# Altium schematic sheet 04 TYPEC.SchDoc: CM4 IO
size 420 x 297 mm; Page Create Date: March  8, 1995; Page Number: 4; Page Size: A3; Comment: radxa_1010; Page Count: 19; RevCode: V1.10; Doc: 04 TYPEC; DsnPath: D:\WMS\黄工\[RC126]CM4_IO_V1.10\[RC126]_V1.10\CM4 IO_V1.10.DSN; SchematicName: CM4 IO V1.10; PageName: 04 TYPEC; PageSize: A3; TopSchematic: True
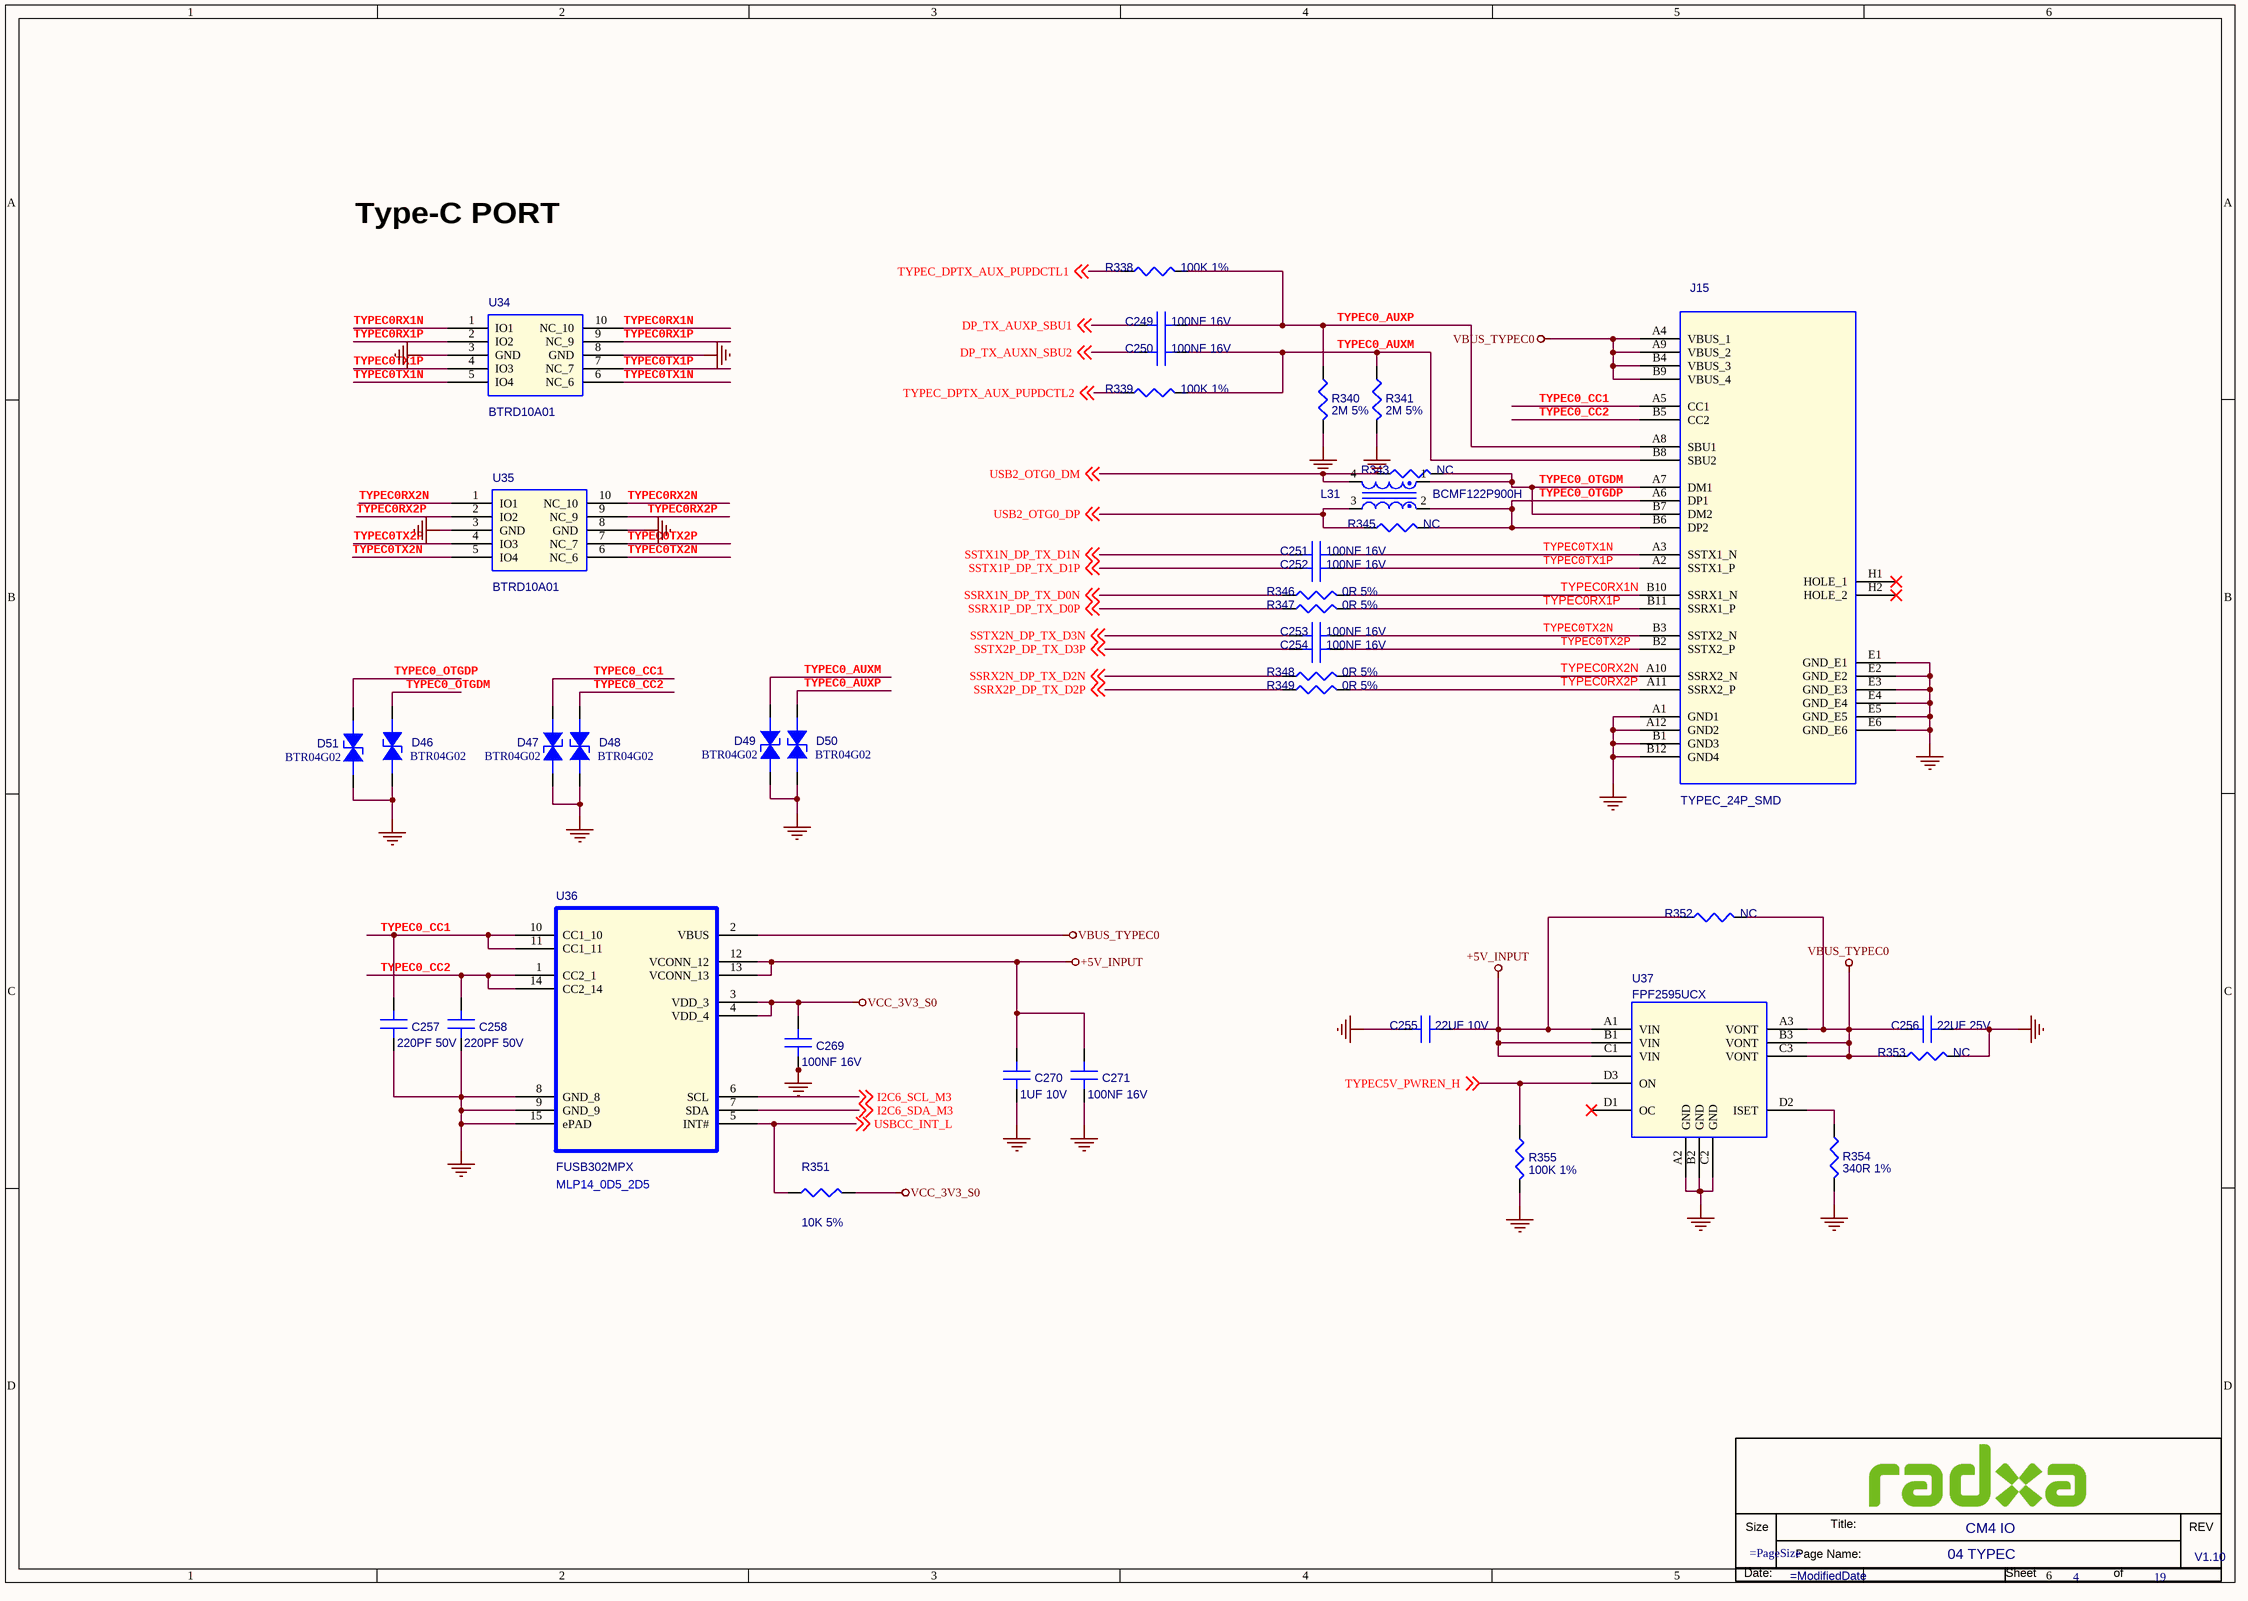
[diagram p0: 04 TYPEC.SchDoc]

## Parts
*  Doc: 04 TYPEC  RevCode: V1.10  Title: CM4 IO  Page Number: 4  Page Count: 19  (hidden comment: radxa_1010)  (graphical)
C249  100NF 16V  [C0201]
C250  100NF 16V  [C0201]
C251  100NF 16V  [C0201]
C252  100NF 16V  [C0201]
C253  100NF 16V  [C0201]
C254  100NF 16V  [C0201]
C255  22UF 10V  [C0603]
C256  22UF 25V  [C0805]
C257  220PF 50V  [C0201]
C258  220PF 50V  [C0201]
C269  100NF 16V  [C0201]
C270  1UF 10V  [C0201]
C271  100NF 16V  [C0201]
D46  BTR04G02  [DFN1006-2L]
D47  BTR04G02  [DFN1006-2L]
D48  BTR04G02  [DFN1006-2L]
D49  BTR04G02  [DFN1006-2L]
D50  BTR04G02  [DFN1006-2L]
D51  BTR04G02  [DFN1006-2L]
J15  TYPEC_24P_SMD  [TYPEC_SM24P_0D5]
L31  BCMF122P900H  [LC1210]
R338  100K 1%  [R0402]
R339  100K 1%  [R0402]
R340  2M 5%  [R0402]
R341  2M 5%  [R0402]
R343  NC  [R0402]
R345  NC  [R0402]
R346  0R 5%  [R0402]
R347  0R 5%  [R0402]
R348  0R 5%  [R0402]
R349  0R 5%  [R0402]
R351  10K 5%  [R0402]
R352  NC  [R0402]
R353  NC  [R0402]
R354  340R 1%  [R0402]
R355  100K 1%  [R0402]
U34  BTRD10A01  [SON10_0D5_1]
U35  BTRD10A01  [SON10_0D5_1]
U36  FUSB302MPX  [MLP14_0D5_2D5]
U37  FPF2595UCX  [WLCSP12_0D4_1D5]

## Nets
+5V_INPUT: C255.1(A) C270.1(A) C271.1(A) R352.1 U36.12(VCONN_12) U36.13(VCONN_13) U37.A1(VIN) U37.B1(VIN) U37.C1(VIN)
GND: C255.2(B) C256.2(B) C257.2(B) C258.2(B) C269.2(B) C270.2(B) C271.2(B) D46.1(ANODE) D47.1(ANODE) D48.1(ANODE) D49.1(ANODE) D50.1(ANODE) D51.1(ANODE) J15.A1(GND1) J15.A12(GND2) J15.B1(GND3) J15.B12(GND4) J15.E1(GND_E1) J15.E2(GND_E2) J15.E3(GND_E3) J15.E4(GND_E4) J15.E5(GND_E5) J15.E6(GND_E6) R340.2 R341.2 R353.2 R354.2 R355.2 U34.3(GND) U34.8(GND) U35.3(GND) U35.8(GND) U36.8(GND_8) U36.9(GND_9) U36.15(ePAD) U37.A2(GND) U37.B2(GND) U37.C2(GND)
VBUS_TYPEC0: C256.1(A) J15.A4(VBUS_1) J15.A9(VBUS_2) J15.B4(VBUS_3) J15.B9(VBUS_4) R352.2 R353.1 U36.2(VBUS) U37.A3(VONT) U37.B3(VONT) U37.C3(VONT)
VCC_3V3_S0: C269.1(A) R351.1 U36.3(VDD_3) U36.4(VDD_4)
DP_TX_AUXN_SBU2: C250.1(A) ; off-sheet DP_TX_AUXN_SBU2
DP_TX_AUXP_SBU1: C249.1(A) ; off-sheet DP_TX_AUXP_SBU1
I2C6_SCL_M3: U36.6(SCL) ; off-sheet I2C6_SCL_M3
I2C6_SDA_M3: U36.7(SDA) ; off-sheet I2C6_SDA_M3
SSRX1N_DP_TX_D0N: R346.1 ; off-sheet SSRX1N_DP_TX_D0N
SSRX1P_DP_TX_D0P: R347.1 ; off-sheet SSRX1P_DP_TX_D0P
SSRX2N_DP_TX_D2N: R348.1 ; off-sheet SSRX2N_DP_TX_D2N
SSRX2P_DP_TX_D2P: R349.1 ; off-sheet SSRX2P_DP_TX_D2P
SSTX1N_DP_TX_D1N: C251.1(A) ; off-sheet SSTX1N_DP_TX_D1N
SSTX1P_DP_TX_D1P: C252.1(A) ; off-sheet SSTX1P_DP_TX_D1P
SSTX2N_DP_TX_D3N: C253.1(A) ; off-sheet SSTX2N_DP_TX_D3N
SSTX2P_DP_TX_D3P: C254.1(A) ; off-sheet SSTX2P_DP_TX_D3P
TYPEC0_AUXM: C250.2(B) D49.2(CATHODE) J15.B8(SBU2) R339.2 R341.1
TYPEC0_AUXP: C249.2(B) D50.2(CATHODE) J15.A8(SBU1) R338.2 R340.1
TYPEC0_CC1: C257.1(A) D47.2(CATHODE) J15.A5(CC1) U36.10(CC1_10) U36.11(CC1_11)
TYPEC0_CC2: C258.1(A) D48.2(CATHODE) J15.B5(CC2) U36.1(CC2_1) U36.14(CC2_14)
TYPEC0_OTGDM: D46.2(CATHODE) J15.A7(DM1) J15.B7(DM2) L31.1 R343.2
TYPEC0_OTGDP: D51.2(CATHODE) J15.A6(DP1) J15.B6(DP2) L31.2 R345.2
TYPEC0RX1N: J15.B10(SSRX1_N) R346.2 U34.1(IO1) U34.10(NC_10)
TYPEC0RX1P: J15.B11(SSRX1_P) R347.2 U34.2(IO2) U34.9(NC_9)
TYPEC0RX2N: J15.A10(SSRX2_N) R348.2 U35.1(IO1) U35.10(NC_10)
TYPEC0RX2P: J15.A11(SSRX2_P) R349.2 U35.2(IO2) U35.9(NC_9)
TYPEC0TX1N: C251.2(B) J15.A3(SSTX1_N) U34.5(IO4) U34.6(NC_6)
TYPEC0TX1P: C252.2(B) J15.A2(SSTX1_P) U34.4(IO3) U34.7(NC_7)
TYPEC0TX2N: C253.2(B) J15.B3(SSTX2_N) U35.5(IO4) U35.6(NC_6)
TYPEC0TX2P: C254.2(B) J15.B2(SSTX2_P) U35.4(IO3) U35.7(NC_7)
TYPEC5V_PWREN_H: R355.1 U37.D3(ON) ; off-sheet TYPEC5V_PWREN_H
TYPEC_DPTX_AUX_PUPDCTL1: R338.1 ; off-sheet TYPEC_DPTX_AUX_PUPDCTL1
TYPEC_DPTX_AUX_PUPDCTL2: R339.1 ; off-sheet TYPEC_DPTX_AUX_PUPDCTL2
USB2_OTG0_DM: L31.4 R343.1 ; off-sheet USB2_OTG0_DM
USB2_OTG0_DP: L31.3 R345.1 ; off-sheet USB2_OTG0_DP
USBCC_INT_L: R351.2 U36.5(INT#) ; off-sheet USBCC_INT_L
NetR354_1: R354.1 U37.D2(ISET)

Not connected (* = marked no-connect by the designer): J15 H1(HOLE_1)* H2(HOLE_2)*; U37 D1(OC)*

## Notes on the sheet
- Type-C PORT
- (in symbol radxa_1010) Size; Title:; REV; Page Name:; Date:; Sheet; of

## Library data of the parts
C249 = C: SMD  0201  100NF  16V  X5R  ±20%  ROHS; PARTS: 1; Part Reference: C249; Part Number: A1C01.00099; OriginalSymbolOrigin: (0,30); PKG_TYPE: CAP2-100-250; LEVEL: STD; PINSWAP: (A,B); Preferred: 6715f349cd0bc5; Value: 100NF 16V; Part Type: 陶瓷电容; PCB Footprint: C0201
C250 = C: SMD  0201  100NF  16V  X5R  ±20%  ROHS; PARTS: 1; Part Reference: C250; Part Number: A1C01.00099; OriginalSymbolOrigin: (0,30); PKG_TYPE: CAP2-100-250; LEVEL: STD; PINSWAP: (A,B); Preferred: 6715f349cd0bc5; Value: 100NF 16V; Part Type: 陶瓷电容; PCB Footprint: C0201
C251 = C: SMD  0201  100NF  16V  X5R  ±20%  ROHS; PARTS: 1; Part Reference: C251; Part Number: A1C01.00099; OriginalSymbolOrigin: (0,30); PKG_TYPE: CAP2-100-250; LEVEL: STD; PINSWAP: (A,B); Preferred: 6715f349cd0bc5; Value: 100NF 16V; Part Type: 陶瓷电容; PCB Footprint: C0201
C252 = C: SMD  0201  100NF  16V  X5R  ±20%  ROHS; PARTS: 1; Part Reference: C252; Part Number: A1C01.00099; OriginalSymbolOrigin: (0,30); PKG_TYPE: CAP2-100-250; LEVEL: STD; PINSWAP: (A,B); Preferred: 6715f349cd0bc5; Value: 100NF 16V; Part Type: 陶瓷电容; PCB Footprint: C0201
C253 = C: SMD  0201  100NF  16V  X5R  ±20%  ROHS; PARTS: 1; Part Reference: C253; Part Number: A1C01.00099; OriginalSymbolOrigin: (0,30); PKG_TYPE: CAP2-100-250; LEVEL: STD; PINSWAP: (A,B); Preferred: 6715f349cd0bc5; Value: 100NF 16V; Part Type: 陶瓷电容; PCB Footprint: C0201
C254 = C: SMD  0201  100NF  16V  X5R  ±20%  ROHS; PARTS: 1; Part Reference: C254; Part Number: A1C01.00099; OriginalSymbolOrigin: (0,30); PKG_TYPE: CAP2-100-250; LEVEL: STD; PINSWAP: (A,B); Preferred: 6715f349cd0bc5; Value: 100NF 16V; Part Type: 陶瓷电容; PCB Footprint: C0201
C255 = C: SMD  0603  22UF  10V  X5R  ±20%  ROHS; PARTS: 1; Part Reference: C255; Part Number: A1C01.00015; OriginalSymbolOrigin: (0,30); PKG_TYPE: CAP2-100-250; LEVEL: STD; PINSWAP: (A,B); Preferred: 6715f349cd0bc5; Value: 22UF 10V; Part Type: 陶瓷电容; PCB Footprint: C0603
C256 = C: SMD  0805  22UF  25V  X5R  ±20%  ROHS; PARTS: 1; Part Reference: C256; Part Number: A1C01.00249; OriginalSymbolOrigin: (0,30); PKG_TYPE: CAP2-100-250; LEVEL: STD; PINSWAP: (A,B); Preferred: 6715f349cd0bc5; Value: 22UF 25V; Part Type: 陶瓷电容
C257 = C: SMD  0201  220PF  50V  NPO  ±5%  ROHS; PARTS: 1; Part Reference: C257; Part Number: A1C01.00383; OriginalSymbolOrigin: (0,30); PKG_TYPE: CAP2-100-250; LEVEL: STD; PINSWAP: (A,B); Preferred: 6715f349cd0bc5; Value: 220PF 50V; Part Type: 陶瓷电容; PCB Footprint: C0201
C258 = C: SMD  0201  220PF  50V  NPO  ±5%  ROHS; PARTS: 1; Part Reference: C258; Part Number: A1C01.00383; OriginalSymbolOrigin: (0,30); PKG_TYPE: CAP2-100-250; LEVEL: STD; PINSWAP: (A,B); Preferred: 6715f349cd0bc5; Value: 220PF 50V; Part Type: 陶瓷电容; PCB Footprint: C0201
C269 = C: SMD  0201  100NF  16V  X5R  ±20%  ROHS; PARTS: 1; Part Reference: C269; Part Number: A1C01.00099; OriginalSymbolOrigin: (0,30); PKG_TYPE: CAP2-100-250; LEVEL: STD; PINSWAP: (A,B); Preferred: 6715f349cd0bc5; Value: 100NF 16V; Part Type: 陶瓷电容; PCB Footprint: C0201
C270 = C: SMD  0201  1UF  10V  X5R  ±20%  ROHS; PARTS: 1; Part Reference: C270; Part Number: A1C01.00081; OriginalSymbolOrigin: (0,30); PKG_TYPE: CAP2-100-250; LEVEL: STD; PINSWAP: (A,B); Preferred: 6715f349cd0bc5; Value: 1UF 10V; Part Type: 陶瓷电容; PCB Footprint: C0201
C271 = C: SMD  0201  100NF  16V  X5R  ±20%  ROHS; PARTS: 1; Part Reference: C271; Part Number: A1C01.00099; OriginalSymbolOrigin: (0,30); PKG_TYPE: CAP2-100-250; LEVEL: STD; PINSWAP: (A,B); Preferred: 6715f349cd0bc5; Value: 100NF 16V; Part Type: 陶瓷电容; PCB Footprint: C0201
D46 = ESD: SMD  编带  0402  BTR04G02  B-tron  ROHS; Part Reference: D46; Part Number: A1D02.00002; Parameter: ESD-台舟 ESD5341N-封装 esd0402; ID: DE-E0004; Preferred: 6715f349cd0bc5; Temp Coeff: -50℃ to +125℃; PCB Footprint: ESD_D0402; Value: BTR04G02; Part Type: 二极管-ESD管-桥堆-TVS管
D47 = ESD: SMD  编带  0402  BTR04G02  B-tron  ROHS; Part Reference: D47; Part Number: A1D02.00002; Parameter: ESD-台舟 ESD5341N-封装 esd0402; ID: DE-E0004; Preferred: 6715f349cd0bc5; Temp Coeff: -50℃ to +125℃; PCB Footprint: ESD_D0402; Value: BTR04G02; Part Type: 二极管-ESD管-桥堆-TVS管
D48 = ESD: SMD  编带  0402  BTR04G02  B-tron  ROHS; Part Reference: D48; Part Number: A1D02.00002; Parameter: ESD-台舟 ESD5341N-封装 esd0402; ID: DE-E0004; Preferred: 6715f349cd0bc5; Temp Coeff: -50℃ to +125℃; PCB Footprint: ESD_D0402; Value: BTR04G02; Part Type: 二极管-ESD管-桥堆-TVS管
D49 = ESD: SMD  编带  0402  BTR04G02  B-tron  ROHS; Part Reference: D49; Part Number: A1D02.00002; Parameter: ESD-台舟 ESD5341N-封装 esd0402; ID: DE-E0004; Temp Coeff: -50℃ to +125℃; Preferred: 6715f349cd0bc5; PCB Footprint: ESD_D0402; Value: BTR04G02; Part Type: 二极管-ESD管-桥堆-TVS管
D50 = ESD: SMD  编带  0402  BTR04G02  B-tron  ROHS; Part Reference: D50; Part Number: A1D02.00002; Parameter: ESD-台舟 ESD5341N-封装 esd0402; ID: DE-E0004; Temp Coeff: -50℃ to +125℃; Preferred: 6715f349cd0bc5; PCB Footprint: ESD_D0402; Value: BTR04G02; Part Type: 二极管-ESD管-桥堆-TVS管
D51 = ESD: SMD  编带  0402  BTR04G02  B-tron  ROHS; Part Reference: D51; Part Number: A1D02.00002; Parameter: ESD-台舟 ESD5341N-封装 esd0402; ID: DE-E0004; Preferred: 6715f349cd0bc5; Temp Coeff: -50℃ to +125℃; PCB Footprint: ESD_D0402; Value: BTR04G02; Part Type: 二极管-ESD管-桥堆-TVS管
J15 = TYPEC_24P_SMD_2: SMD  母座  2*12PIN  双排  8.94x7.9xH3.2mm  带定位柱  不锈钢  兴联  BUSF242B3N11677  ROHS; Part Reference: J15; Part Number: A1J04.00021; Preferred: 6715f349cd0bc5; Temp Coeff: -25℃ to +85℃; Value: TYPEC_24P_SMD; Part Type: TYPEC座
L31 = MCZ1210AH900L2: SMD  BCMF122P900H  90R  4PIN  不带ESD  ±5%  B-tron  ROHS; Part Reference: L31; Part Number: A1L03.00003; PCB Footprint: CML_SM4_0D6_1D5; Preferred: 6715f349cd0bc5; Temp Coeff: -40℃ to +105℃; Value: BCMF122P900H; Part Type: 共模电感
R338 = R: SMD  0201  100K  1/20W  ±1%  ROHS; Part Reference: R338; Part Number: A1R01.00165; Preferred: 6715f349cd0bc5; Value: 100K 1%; Part Type: 贴片电阻
R339 = R: SMD  0201  100K  1/20W  ±1%  ROHS; Part Reference: R339; Part Number: A1R01.00165; PCB Footprint: R0201; Preferred: 6715f349cd0bc5; Value: 100K 1%; Part Type: 贴片电阻
R340 = R: SMD  0201  2M  1/20W  ±5%  ROHS; Part Reference: R340; Part Number: A1R01.00114; PCB Footprint: R0201; Temp Coeff: -55℃ to +125℃; Preferred: 6715f349cd0bc5; Value: 2M 5%; Part Type: 贴片电阻
R341 = R: SMD  0201  2M  1/20W  ±5%  ROHS; Part Reference: R341; Part Number: A1R01.00114; PCB Footprint: R0201; Temp Coeff: -55℃ to +125℃; Preferred: 6715f349cd0bc5; Value: 2M 5%; Part Type: 贴片电阻
R343 = R: SMD  0201  0R  1/20W  ±5%  ROHS; Part Reference: R343; Part Number: A1R01.00027; PCB Footprint: R0201; Temp Coeff: -55℃ to +125℃; Preferred: 6715f349cd0bc5; Value: NC; Part Type: 贴片电阻
R345 = R: SMD  0201  0R  1/20W  ±5%  ROHS; Part Reference: R345; Part Number: A1R01.00027; PCB Footprint: R0201; Preferred: 6715f349cd0bc5; Temp Coeff: -55℃ to +125℃; Value: NC; Part Type: 贴片电阻
R346 = R: SMD  0201  0R  1/20W  ±5%  ROHS; Part Reference: R346; Part Number: A1R01.00027; PCB Footprint: R0201; Temp Coeff: -55℃ to +125℃; Preferred: 6715f349cd0bc5; Value: 0R 5%; Part Type: 贴片电阻
R347 = R: SMD  0201  0R  1/20W  ±5%  ROHS; Part Reference: R347; Part Number: A1R01.00027; PCB Footprint: R0201; Temp Coeff: -55℃ to +125℃; Preferred: 6715f349cd0bc5; Value: 0R 5%; Part Type: 贴片电阻
R348 = R: SMD  0201  0R  1/20W  ±5%  ROHS; Part Reference: R348; Part Number: A1R01.00027; PCB Footprint: R0201; Temp Coeff: -55℃ to +125℃; Preferred: 6715f349cd0bc5; Value: 0R 5%; Part Type: 贴片电阻
R349 = R: SMD  0201  0R  1/20W  ±5%  ROHS; Part Reference: R349; Part Number: A1R01.00027; PCB Footprint: R0201; Temp Coeff: -55℃ to +125℃; Preferred: 6715f349cd0bc5; Value: 0R 5%; Part Type: 贴片电阻
R351 = R: SMD  0201  10K  1/20W  ±5%  ROHS; Part Reference: R351; Part Number: A1R01.00012; Temp Coeff: -55℃ to +125℃; Preferred: 6715f349cd0bc5; Value: 10K 5%; Part Type: 贴片电阻
R352 = R: SMD  0402  0R  1/16W  ±5%  ROHS; Part Reference: R352; Part Number: A1R01.00030; Temp Coeff: -55℃ to +155℃; Preferred: 6715f349cd0bc5; PCB Footprint: R0402; Value: NC; Part Type: 贴片电阻
R353 = R: SMD  0201  4.7K  1/20W  ±5%  ROHS; Part Reference: R353; Part Number: A1R01.00014; PCB Footprint: R0201; Preferred: 6715f349cd0bc5; Temp Coeff: -55℃ to +125℃; Value: NC; Part Type: 贴片电阻
R354 = R: SMD  0201  340R  1/20W  ±1%  ROHS; Part Reference: R354; Part Number: A1R01.00512; PCB Footprint: R0201; Temp Coeff: -55℃ to +125℃; Preferred: 6715f349cd0bc5; Value: 340R 1%; Part Type: 贴片电阻
R355 = R: SMD  0201  100K  1/20W  ±1%  ROHS; Part Reference: R355; Part Number: A1R01.00165; PCB Footprint: R0201; Preferred: 6715f349cd0bc5; Value: 100K 1%; Part Type: 贴片电阻
U34 = BTRD10A01: SMD  编带  DFN2510-10L  BTRD10A01  4Line  0.1pF  B-tron  ROHS; Part Reference: U34; Part Number: A1D02.00106; Preferred: 6715f349cd0bc5; Temp Coeff: -55℃ to +125℃; Value: BTRD10A01; Part Type: 二极管-ESD管-桥堆-TVS管
U35 = BTRD10A01: SMD  编带  DFN2510-10L  BTRD10A01  4Line  0.1pF  B-tron  ROHS; Part Reference: U35; Part Number: A1D02.00106; Preferred: 6715f349cd0bc5; Temp Coeff: -55℃ to +125℃; Value: BTRD10A01; Part Type: 二极管-ESD管-桥堆-TVS管
U36 = FUSB302MPX: SMD  USB转换芯片  FUSB302MPX  MLP14  onsemi(安森美)  ROHS; Part Reference: U36; Part Number: A1I01.00760; Temp Coeff: -40℃ to +85℃; Preferred: 6715f349cd0bc5; PCB Footprint: MLP14_0D5_2D5; Value: FUSB302MPX; Part Type: 集成电路/模块
U37 = FPF2595UCX: SMD  功率电子开关  FPF2595UCX  WLCSP12  ON(安森美)  ROHS; Part Reference: U37; Part Number: A1I01.00675; Preferred: 6715f349cd0bc5; Temp Coeff: -40℃ to +85℃; PCB Footprint: WLCSP12_0D4_1D5; Value: FPF2595UCX; Part Type: 集成电路/模块
* = radxa_1010: Page Create Date: March  8, 1995; Page Size: =PageSize; Page Modify Date: =ModifiedDate